# Altium project iMX6 Rex Development Baseboard V1I1.PrjPcb (part 3 of 5)

## Sheet [11] - AUDIO1.SchDoc
size A2; DocumentNumber: 2; SheetNumber: 11; SheetTotal: 20
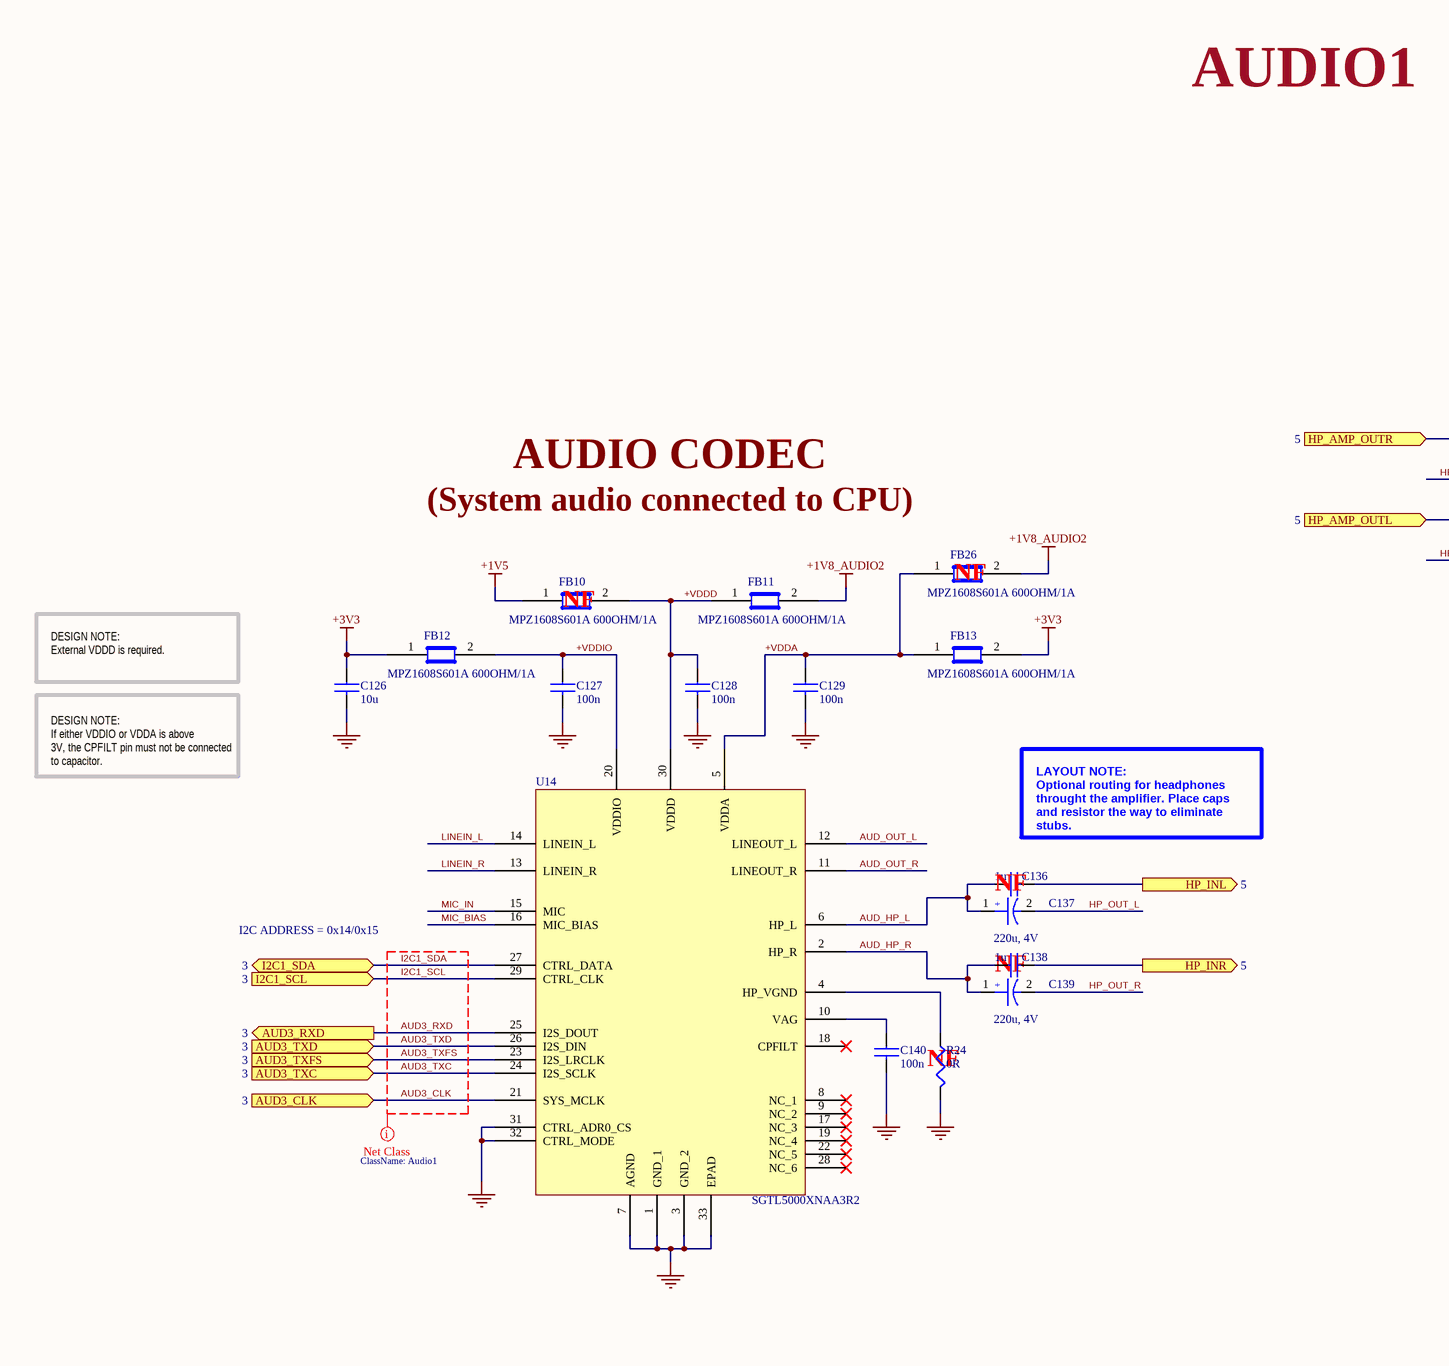
[diagram p7: [11] - AUDIO1.SchDoc, left]
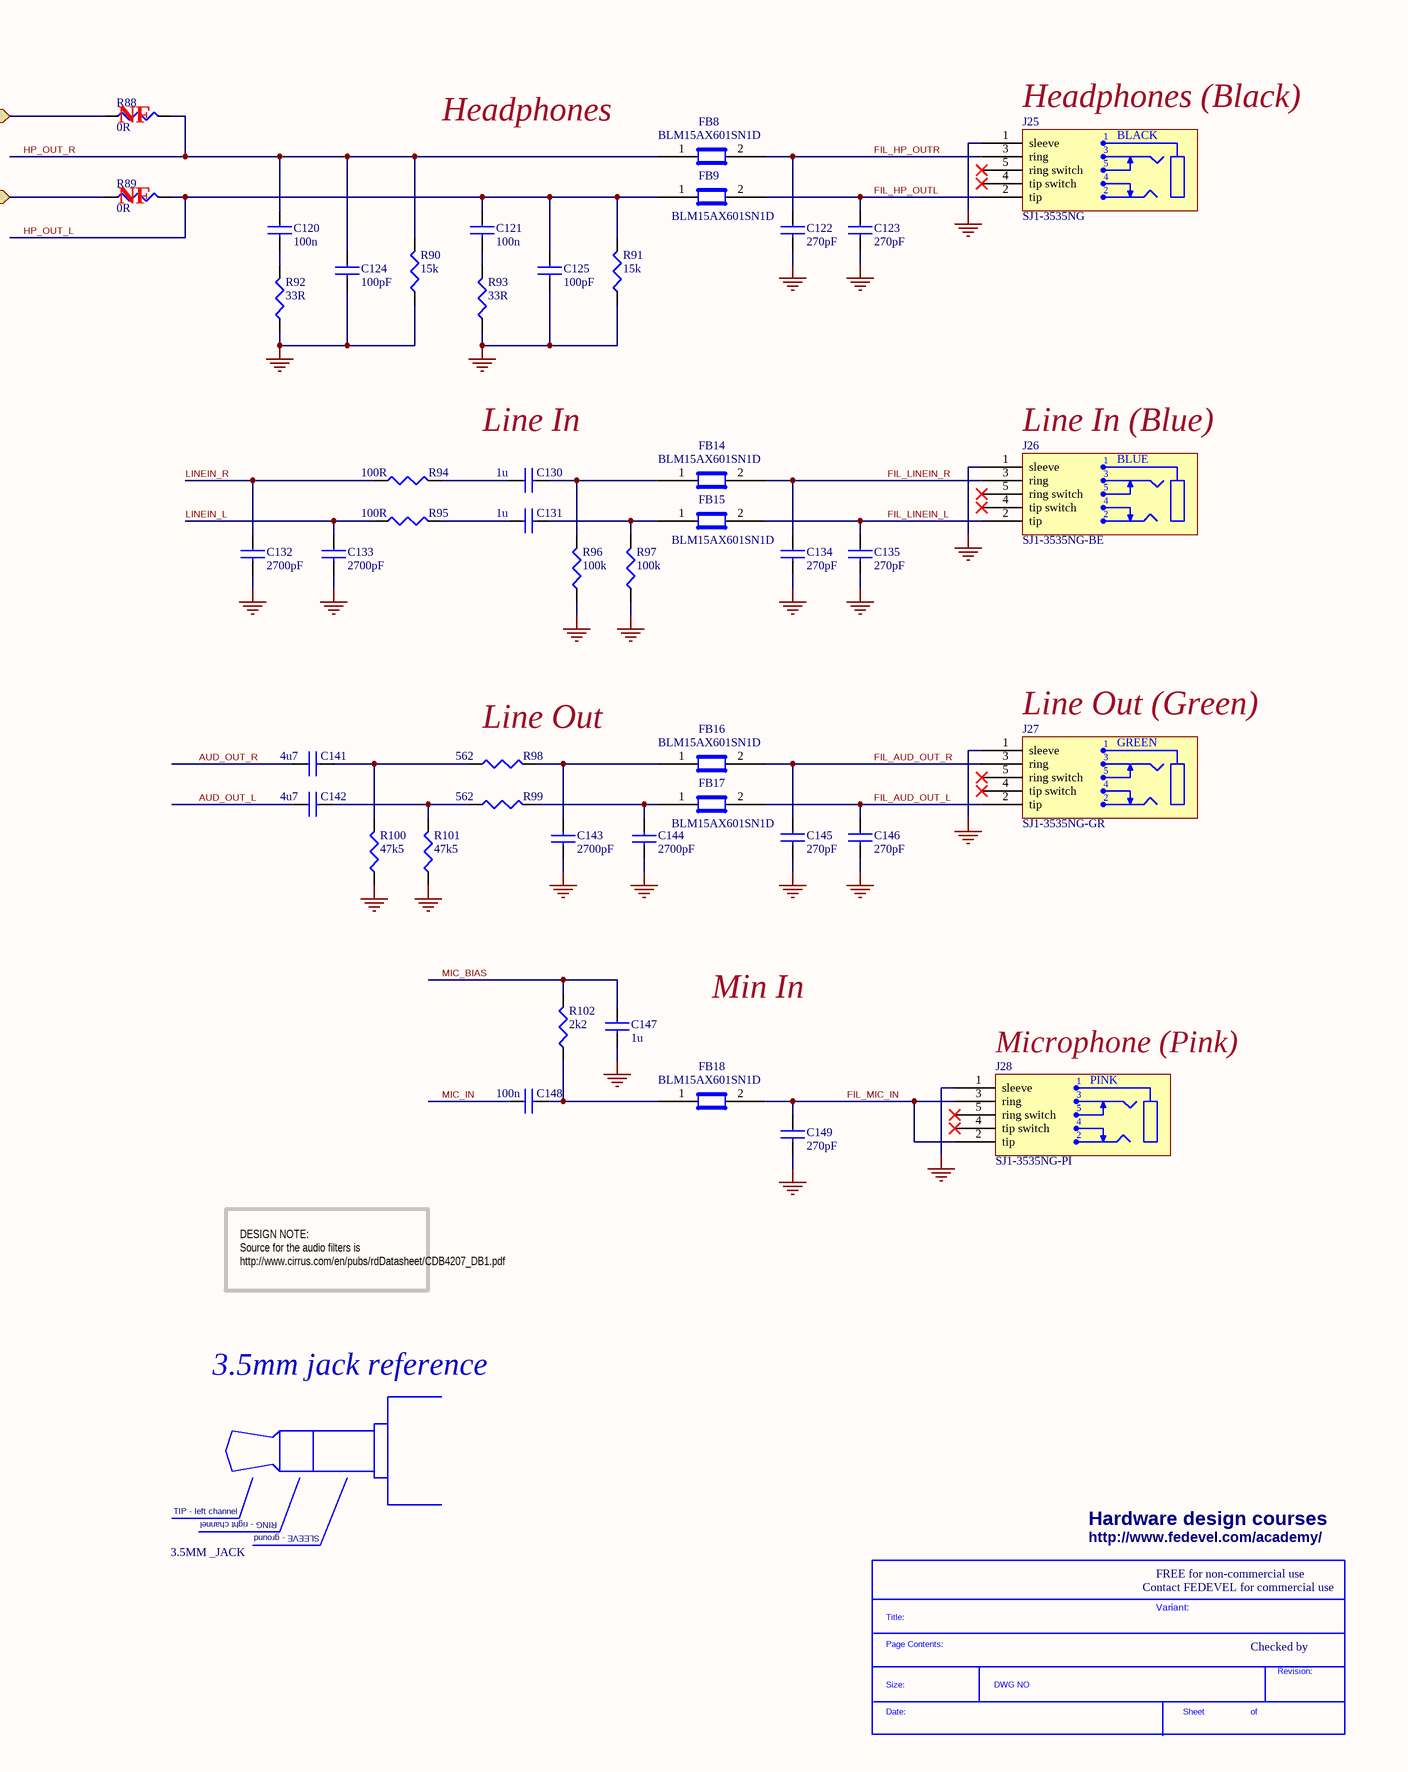
[diagram p8: [11] - AUDIO1.SchDoc, right]

### Parts
(Parts that share a designator on the sheet are numbered #1, #2 ... from top to bottom, then left to right.)
*#6  3.5MM _JACK  (graphical)
*#7  SDTitleBlock  (value not drawn)  (graphical)
C120  100n  [C0402]
C121  100n  [C0402]
C122  270pF  [C0402]
C123  270pF  [C0402]
C124  100pF  [C0402]
C125  100pF  [C0402]
C126  10u  [C0603]
C127  100n  [C0402]
C128  100n  [C0402]
C129  100n  [C0402]
C130  1u  [C0402]
C131  1u  [C0402]
C132  2700pF  [C0402]
C133  2700pF  [C0402]
C134  270pF  [C0402]
C135  270pF  [C0402]
C136  1u  [C0402]
C137  220u, 4V  [C1206 -  TLN S Case Tantal]
C138  1u  [C0402]
C139  220u, 4V  [C1206 -  TLN S Case Tantal]
C140  100n  [C0402]
C141  4u7  [C0402]
C142  4u7  [C0402]
C143  2700pF  [C0402]
C144  2700pF  [C0402]
C145  270pF  [C0402]
C146  270pF  [C0402]
C147  1u  [C0402]
C148  100n  [C0402]
C149  270pF  [C0402]
FB8  BLM15AX601SN1D  [C0402]
FB9  BLM15AX601SN1D  [C0402]
FB10  MPZ1608S601A 600OHM/1A  [C0603]
FB11  MPZ1608S601A 600OHM/1A  [C0603]
FB12  MPZ1608S601A 600OHM/1A  [C0603]
FB13  MPZ1608S601A 600OHM/1A  [C0603]
FB14  BLM15AX601SN1D  [C0402]
FB15  BLM15AX601SN1D  [C0402]
FB16  BLM15AX601SN1D  [C0402]
FB17  BLM15AX601SN1D  [C0402]
FB18  BLM15AX601SN1D  [C0402]
FB26  MPZ1608S601A 600OHM/1A  [C0603]
J25  SJ1-3535NG  [SJ1-3535NG]
J26  SJ1-3535NG-BE  [SJ1-3535NG]
J27  SJ1-3535NG-GR  [SJ1-3535NG]
J28  SJ1-3535NG-PI  [SJ1-3535NG]
R24  0R  [R0402]
R88  0R  [R0402]
R89  0R  [R0402]
R90  15k  [R0402]
R91  15k  [R0402]
R92  33R  [R0402]
R93  33R  [R0402]
R94  100R  [R0402]
R95  100R  [R0402]
R96  100k  [R0402]
R97  100k  [R0402]
R98  562  [R0402]
R99  562  [R0402]
R100  47k5  [R0402]
R101  47k5  [R0402]
R102  2k2  [R0402]
U14  SGTL5000XNAA3R2  [QFN32 5x5x0.85]

### Ports
AUD3_CLK (in, see 3), AUD3_RXD (out, see 3), AUD3_TXC (in, see 3), AUD3_TXD (in, see 3), AUD3_TXFS (in, see 3), HP_AMP_OUTL (in, see 5), HP_AMP_OUTR (in, see 5), HP_INL (out, see 5), HP_INR (out, see 5), I2C1_SCL (in, see 3), I2C1_SDA (bidir, see 3)

### Nets
+1V5: FB10.1
+1V8_AUDIO2: FB11.2 FB26.2
+3V3: C126.1 FB12.1 FB13.2
GND: C122.2 C123.2 C124.2 C125.2 C126.2 C127.2 C128.2 C129.2 C132.2 C133.2 C134.2 C135.2 C140.2 C143.1 C144.1 C145.2 C146.2 C147.2 C149.2 J25.1(sleeve) J26.1(sleeve) J27.1(sleeve) J28.1(sleeve) R24.2 R90.1 R91.1 R92.1 R93.1 R96.1 R97.1 R100.1 R101.1 U14.1(GND_1) U14.3(GND_2) U14.7(AGND) U14.31(CTRL_ADR0_CS) U14.32(CTRL_MODE) U14.33(EPAD)
+VDDA: C129.1 FB13.1 FB26.1 U14.5(VDDA)
+VDDD: C128.1 FB10.2 FB11.1 U14.30(VDDD)
+VDDIO: C127.1 FB12.2 U14.20(VDDIO)
AUD3_CLK: U14.21(SYS_MCLK) ; port AUD3_CLK
AUD3_RXD: U14.25(I2S_DOUT) ; port AUD3_RXD
AUD3_TXC: U14.24(I2S_SCLK) ; port AUD3_TXC
AUD3_TXD: U14.26(I2S_DIN) ; port AUD3_TXD
AUD3_TXFS: U14.23(I2S_LRCLK) ; port AUD3_TXFS
AUD_HP_L: C136.1 C137.1 U14.6(HP_L)
AUD_HP_R: C138.1 C139.1 U14.2(HP_R)
AUD_OUT_L: C142.1 U14.12(LINEOUT_L)
AUD_OUT_R: C141.1 U14.11(LINEOUT_R)
FIL_AUD_OUT_L: C146.1 FB17.2 J27.2(tip)
FIL_AUD_OUT_R: C145.1 FB16.2 J27.3(ring)
FIL_HP_OUTL: C123.1 FB9.2 J25.2(tip)
FIL_HP_OUTR: C122.1 FB8.2 J25.3(ring)
FIL_LINEIN_L: C135.1 FB15.2 J26.2(tip)
FIL_LINEIN_R: C134.1 FB14.2 J26.3(ring)
FIL_MIC_IN: C149.1 FB18.2 J28.2(tip) J28.3(ring)
HP_AMP_OUTL: R89.1 ; port HP_AMP_OUTL
HP_AMP_OUTR: R88.1 ; port HP_AMP_OUTR
HP_INL: C136.2 ; port HP_INL
HP_INR: C138.2 ; port HP_INR
HP_OUT_L: C121.1 C125.1 C137.2 FB9.1 R89.2 R91.2
HP_OUT_R: C120.1 C124.1 C139.2 FB8.1 R88.2 R90.2
I2C1_SCL: U14.29(CTRL_CLK) ; port I2C1_SCL
I2C1_SDA: U14.27(CTRL_DATA) ; port I2C1_SDA
LINEIN_L: C133.1 R95.1 U14.14(LINEIN_L)
LINEIN_R: C132.1 R94.1 U14.13(LINEIN_R)
MIC_BIAS: C147.1 R102.2 U14.16(MIC_BIAS)
MIC_IN: C148.1 U14.15(MIC)
NetC120_2: C120.2 R92.2
NetC121_2: C121.2 R93.2
NetC130_1: C130.1 R94.2
NetC130_2: C130.2 FB14.1 R96.2
NetC131_1: C131.1 R95.2
NetC131_2: C131.2 FB15.1 R97.2
NetC140_1: C140.1 U14.10(VAG)
NetC141_2: C141.2 R98.1 R100.2
NetC142_2: C142.2 R99.1 R101.2
NetC143_2: C143.2 FB16.1 R98.2
NetC144_2: C144.2 FB17.1 R99.2
NetC148_2: C148.2 FB18.1 R102.1
NetR24_1: R24.1 U14.4(HP_VGND)

Not connected (* = marked no-connect by the designer): J25 4(tip_switch)* 5(ring_switch)*; J26 4(tip_switch)* 5(ring_switch)*; J27 4(tip_switch)* 5(ring_switch)*; J28 4(tip_switch)* 5(ring_switch)*; U14 8(NC_1)* 9(NC_2)* 17(NC_3)* 18(CPFILT)* 19(NC_4)* 22(NC_5)* 28(NC_6)*

### Layout directives
net class Audio1: AUD3_CLK, AUD3_RXD, AUD3_TXC, AUD3_TXD, AUD3_TXFS, I2C1_SCL, I2C1_SDA

### Notes on the sheet
- AUDIO1
- (near J25) Headphones (Black)
- AUDIO CODEC
- (near R88) NF
- Headphones
- (System audio connected to CPU)
- (near R89) NF
- (near FB10) NF
- (near FB26) NF
- DESIGN NOTE:
  External VDDD is required.
- DESIGN NOTE:
  If either VDDIO or VDDA is above
  3V, the CPFILT pin must not be connected to capacitor.
- (near C130) Line In
- (near J26) Line In (Blue)
- (near C136) LAYOUT NOTE:
  Optional routing for headphones throught the amplifier. Place caps and resistor the way to eliminate stubs.
- (near C136) NF
- I2C ADDRESS = 0x14/0x15
- (near C138) NF
- (near J27) Line Out (Green)
- (near R24) NF
- (near R98) Line Out
- Min In
- (near J28) Microphone (Pink)
- DESIGN NOTE:
  Source for the audio filters is http://www.cirrus.com/en/pubs/rdDatasheet/CDB4207_DB1.pdf
- 3.5mm jack reference
- Hardware design courses
- http://www.fedevel.com/academy/
- Contact FEDEVEL for commercial use
- FREE for non-commercial use
- Variant:
- Checked by
- (in symbol 3.5MM _JACK) TIP - left channel; RING - right channel; SLEEVE - ground
- (in symbol SDTitleBlock) Title:; Page Contents:; Revision:; Size:; DWG NO; Date:; Sheet; of
- (in symbol SJ1-3535NG) BLACK
- (in symbol SJ1-3535NG-BE) BLUE
- (in symbol SJ1-3535NG-GR) GREEN
- (in symbol SJ1-3535NG-PI) PINK
- (in symbol TLNS227M004R3000) +

### Library data of the parts
C120 C121 C127-C129 C140 C148 = C1005X5R1H104K: CAP CER .10UF 50V X5R 10% 0402; Manufacturer: TDK Corporation; Capacitance: 0.1µF; Value: 100nF; .Checked PCB: used; Description: CAP CER 0.1UF 50V 10% X5R 0402; Category: Capacitors; Supplier Part Number: 445-5942-1-ND; Manufacturer Part Number: C1005X5R1H104K; Operating Temperature: -55°C ~ 85°C; Package / Case: 0402 (1005 Metric); Price 1k [$]: 0.02340; .Checked SCH: used; Voltage - Rated: 50V; Supplier: Digikey; Supplier 1: Digi-Key; Supplier Part Number 1: 445-5942-1-ND; RoHS: RoHS Compliant; Stock 1: 106926; Pricing 1: 1=0.27, 10=0.18, 100=0.072, 250=0.05176, 500=0.0369, 1000=0.027 (USD); Tolerance: ±10%; Temperature Coefficient: X5R; Mounting Type: Surface Mount, MLCC; Applications: General Purpose; Ratings: -; Size / Dimension: 0.039" L x 0.020" W (1.00mm x 0.50mm); Height - Seated (Max): -; Thickness (Max): 0.022" (0.55mm); Lead Spacing: -; Features: -; Packaging: Cut Tape (CT); Lead Style: -; ComponentLink1URL: http://www.tdk.co.jp/tefe02/e412_c.pdf; ComponentLink1Description: http://www.tdk.co.jp/tefe02/e412_c.pdf
C122 C123 C134 C135 C145 C146 C149 = GRM155R71H271KA01D: CAP CER 270PF 50V 10% X7R 0402; Manufacturer: Murata Electronics North America; .Checked PCB: RF; Supplier 1: Digi-Key; Supplier Part Number 1: 490-1299-1-ND; Manufacturer Part Number: GRM155R71H271KA01D; RoHS: RoHS Compliant; Category: Capacitors; Stock 1: 83894; Pricing 1: 10=0.032, 50=0.0252, 100=0.0189, 250=0.01364, 500=0.01008, 1000=0.00683, 5000=0.00525 (USD); Capacitance: 270pF; Voltage - Rated: 50V; Tolerance: ±10%; Temperature Coefficient: X7R; Mounting Type: Surface Mount, MLCC; Operating Temperature: -55°C ~ 125°C; Applications: General Purpose; Ratings: -; Package / Case: 0402 (1005 Metric); Size / Dimension: 0.039" L x 0.020" W (1.00mm x 0.50mm); Height - Seated (Max): -; Thickness (Max): 0.022" (0.55mm); Lead Spacing: -; Features: -; Packaging: Cut Tape (CT); Lead Style: -; ComponentLink1URL: http://search.murata.co.jp/Ceramy/image/img/PDF/ENG/GRM155R71H271KA01.pdf; ComponentLink1Description: http://search.murata.co.jp/Ceramy/image/img/PDF/ENG/GRM155R71H271KA01.pdf; .Checked SCH: RF
C124 C125 = C1005C0G1H101J: CAP CER 100PF 50V 5% NP0 0402; Manufacturer: TDK Corporation; Temperature Coefficient: C0G, NP0; .Checked PCB: RF; Supplier 1: Digi-Key; Supplier Part Number 1: 445-1247-1-ND; Manufacturer Part Number: C1005C0G1H101J; RoHS: RoHS Compliant; Category: Capacitors; Stock 1: 298233; Pricing 1: 1=0.08, 10=0.05, 100=0.018, 250=0.013, 500=0.0096, 1000=0.0065 (USD); Capacitance: 100pF; Voltage - Rated: 50V; Tolerance: ±5%; Mounting Type: Surface Mount, MLCC; Operating Temperature: -55°C ~ 125°C; Applications: General Purpose; Ratings: -; Package / Case: 0402 (1005 Metric); Size / Dimension: 0.039" L x 0.020" W (1.00mm x 0.50mm); Height - Seated (Max): -; Thickness (Max): 0.022" (0.55mm); Lead Spacing: -; Features: -; Packaging: Cut Tape (CT); Lead Style: -; ComponentLink1URL: http://www.tdk.com/pdf/general_B11.pdf; ComponentLink1Description: http://www.tdk.com/pdf/general_B11.pdf; .Checked SCH: RF
C126 = C1608X5R0J106M: CAP CER 10UF 6.3V X5R 20% 0603; Manufacturer: TDK Corporation; Capacitance: 10µF; Value: 10µF; .Checked PCB: used; Description: CAP CER 10UF 6.3V 20% X5R 0603; Category: Capacitors; Supplier Part Number: 445-4112-1-ND; Manufacturer Part Number: C1608X5R0J106M; Operating Temperature: -55°C ~ 85°C; Package / Case: 0603 (1608 Metric); Price 1k [$]: 0.08580; .Checked SCH: used; Voltage - Rated: 6.3V; Features: Low ESR; Supplier: Digikey; Supplier 1: Digi-Key; Supplier Part Number 1: 445-4112-1-ND; RoHS: RoHS Compliant; Stock 1: 48157; Pricing 1: 1=0.46, 10=0.363, 100=0.1898, 250=0.14024, 500=0.1089, 1000=0.0858 (USD); Tolerance: ±20%; Temperature Coefficient: X5R; Mounting Type: Surface Mount, MLCC; Applications: General Purpose; Ratings: -; Size / Dimension: 0.063" L x 0.031" W (1.60mm x 0.80mm); Height - Seated (Max): -; Thickness (Max): 0.037" (0.95mm); Lead Spacing: -; Packaging: Cut Tape (CT); Lead Style: -; ComponentLink1URL: http://www.tdk.com/pdf/general_B11.pdf; ComponentLink1Description: http://www.tdk.com/pdf/general_B11.pdf
C130 C131 C136 C138 C147 = C1005X5R1C105K: CAP CER 1.0UF 16V X5R 0402; Manufacturer: TDK Corporation; Capacitance: 1.0µF; Value: 1uF; .Checked PCB: used; Description: CAP CER 1UF 16V 10% X5R 0402; Tolerance: ±10%; Category: Capacitors; Supplier Part Number: 445-4978-1-ND; Manufacturer Part Number: C1005X5R1C105K; Operating Temperature: -55°C ~ 85°C; Package / Case: 0402 (1005 Metric); Price 1k [$]: 0.02080; .Checked SCH: used; Voltage - Rated: 16V; Supplier: Digikey; Supplier 1: Digi-Key; Supplier Part Number 1: 445-4978-1-ND; RoHS: RoHS Compliant; Stock 1: 341010; Pricing 1: 1=0.24, 10=0.16, 100=0.064, 250=0.046, 500=0.0328, 1000=0.024 (USD); Temperature Coefficient: X5R; Mounting Type: Surface Mount, MLCC; Applications: General Purpose; Ratings: -; Size / Dimension: 0.039" L x 0.020" W (1.00mm x 0.50mm); Height - Seated (Max): -; Thickness (Max): 0.022" (0.55mm); Lead Spacing: -; Features: -; Packaging: Cut Tape (CT); Lead Style: -; ComponentLink1URL: http://www.tdk.co.jp/tefe02/e412_c.pdf; ComponentLink1Description: http://www.tdk.co.jp/tefe02/e412_c.pdf
C132 C133 C143 C144 = GRM155R71H272KA01D: CAP CER 2700PF 50V 10% X7R 0402; Manufacturer: Murata Electronics North America; .Checked PCB: RF; Supplier 1: Digi-Key; Supplier Part Number 1: 490-1306-1-ND; Manufacturer Part Number: GRM155R71H272KA01D; RoHS: RoHS Compliant; Category: Capacitors; Stock 1: 38160; Pricing 1: 10=0.01, 50=0.0086, 100=0.0074, 250=0.00664, 500=0.00618, 750=0.00571, 1000=0.00542 (USD); Capacitance: 2700pF; Voltage - Rated: 50V; Tolerance: ±10%; Temperature Coefficient: X7R; Mounting Type: Surface Mount, MLCC; Operating Temperature: -55°C ~ 125°C; Applications: General Purpose; Ratings: -; Package / Case: 0402 (1005 Metric); Size / Dimension: 0.039" L x 0.020" W (1.00mm x 0.50mm); Height - Seated (Max): -; Thickness (Max): 0.022" (0.55mm); Lead Spacing: -; Features: -; Packaging: Cut Tape (CT); Lead Style: -; ComponentLink1URL: http://search.murata.co.jp/Ceramy/image/img/PDF/ENG/GRM155R71H272KA01.pdf; ComponentLink1Description: http://search.murata.co.jp/Ceramy/image/img/PDF/ENG/GRM155R71H272KA01.pdf; .Checked SCH: RF
C137 C139 = TLNS227M004R3000: CAP TANT 220UF 4V 20% 1206; Manufacturer: AVX Corporation; Manufacturer Size Code: S; Capacitance: 220µF; ESR (Equivalent Series Resistance): 3.000 Ohm; Type: Molded; .Checked PCB: MM; Supplier 1: Digi-Key; Supplier Part Number 1: 478-5526-1-ND; Manufacturer Part Number: TLNS227M004R3000; RoHS: RoHS Compliant; Category: Capacitors; Stock 1: 21393; Pricing 1: 1=1.35, 10=1.128, 100=0.72, 250=0.6, 500=0.54, 1000=0.492 (USD); Voltage - Rated: 4V; Tolerance: ±20%; Operating Temperature: -55°C ~ 125°C; Mounting Type: Surface Mount; Package / Case: 1206 (3216 Metric); Size / Dimension: 0.126" L x 0.063" W (3.20mm x 1.60mm); Height - Seated (Max): 0.047" (1.20mm); Lead Spacing: -; Features: General Purpose; Packaging: Cut Tape (CT); Lifetime @ Temp.: -; ComponentLink1URL: http://www.avx.com/docs/Catalogs/tlnunder.pdf; ComponentLink1Description: http://www.avx.com/docs/Catalogs/tlnunder.pdf; .Checked SCH: MM
C141 C142 = C1005X5R1A475M: CAP CER 4.7UF 10V 20% X5R 0402; Manufacturer: TDK Corporation; Capacitance: 4.7µF; .Checked PCB: RF; Supplier 1: Digi-Key; Supplier Part Number 1: 445-8023-1-ND; Manufacturer Part Number: C1005X5R1A475M; RoHS: RoHS Compliant; Category: Capacitors; Stock 1: 10140; Pricing 1: 1=0.53, 10=0.415, 100=0.25, 250=0.18752, 500=0.16, 1000=0.125, 5000=0.095 (USD); Voltage - Rated: 10V; Tolerance: ±20%; Temperature Coefficient: X5R; Mounting Type: Surface Mount, MLCC; Operating Temperature: -55°C ~ 85°C; Applications: General Purpose; Ratings: -; Package / Case: 0402 (1005 Metric); Size / Dimension: 0.039" L x 0.020" W (1.00mm x 0.50mm); Height - Seated (Max): -; Thickness (Max): -; Lead Spacing: -; Features: -; Packaging: Cut Tape (CT); Lead Style: -; ComponentLink1URL: http://www.tdk.com/pdf/general_B11.pdf; ComponentLink1Description: http://www.tdk.com/pdf/general_B11.pdf; .Checked SCH: RF
FB8 FB9 FB14-FB18 = BLM15AX601SN1D: FERRITE CHIP 600 OHM 0402 420mA; Manufacturer: Murata Electronics North America; .Checked PCB: used; Impedance @ Frequency: 600 Ohm @ 100MHz; DC Resistance (DCR): 340 mOhm Max; Filter Type: Differential Mode - Single; Number of Lines: 1; .Checked SCH: used; Category: Filters; Supplier Part Number: 490-5441-1-ND; Manufacturer Part Number: BLM15AX601SN1D; Package / Case: 0402 (1005 Metric); Price 1k [$]: 0.03280; Value: BLM15AX601SN1D; Current Rating: 420mA; Supplier: Digikey; Supplier 1: Digi-Key; Supplier Part Number 1: 490-5441-1-ND; RoHS: RoHS Compliant; Description: FERRITE CHIP 600 OHM 0402; Stock 1: 34008; Pricing 1: 1=0.26, 10=0.197, 50=0.1148, 100=0.0918, 250=0.0656, 500=0.0446, 1000=0.03608, 5000=0.02821 (USD); Mounting Type: Surface Mount; Packaging: Cut Tape (CT); Height (Max): 0.022" (0.55mm); Size / Dimension: 0.039" L x 0.020" W (1.00mm x 0.50mm); ComponentLink1URL: http://search.murata.co.jp/Ceramy/image/img/PDF/ENG/L0110S0100BLM15AX_SN.pdf; ComponentLink1Description: http://search.murata.co.jp/Ceramy/image/img/PDF/ENG/L0110S0100BLM15AX_SN.pdf
FB10-FB13 FB26 = MPZ1608S601A: FERRITE CHIP BEAD 600 OHM SMD 1A; Manufacturer: TDK Corporation; Impedance @ Frequency: 600 Ohm @ 100MHz; DC Resistance (DCR): 150 mOhm Max; Filter Type: Differential Mode - Single; Number of Lines: 1; .Checked PCB: RF; Supplier 1: Digi-Key; Supplier Part Number 1: 445-2205-1-ND; Manufacturer Part Number: MPZ1608S601A; RoHS: RoHS Compliant; Description: FERRITE CHIP BEAD 600 OHM SMD; Category: Filters; Stock 1: 328345; Pricing 1: 1=0.36, 10=0.24, 100=0.096, 250=0.069, 500=0.0492, 1000=0.036 (USD); Current Rating: 1A; Package / Case: 0603 (1608 Metric); Mounting Type: Surface Mount; Packaging: Cut Tape (CT); Height (Max): 0.037" (0.95mm); Size / Dimension: 0.063" L x 0.031" W (1.60mm x 0.80mm); ComponentLink1URL: http://www.tdk.co.jp/tefe02/e9413_mpz.pdf; ComponentLink1Description: http://www.tdk.co.jp/tefe02/e9413_mpz.pdf; .Checked SCH: RF
J25 = SJ1-3535NG: CONN JACK STEREO R/A 5PIN 3.5MM; Manufacturer: CUI Inc; Connector Type: Phone Jack; Gender: Female; Plug/Mating Plug Diameter: 3.50mm (0.141", 1/8", Mini Plug) - Headphone; Number of Positions/Contacts: 3 Conductors, 5 Contacts; Internal Switch(s): Two Switches; Shielding: Unshielded; Color - Contact: Black; Voltage - Rated: 16VDC; Current Rating: 300mA; .Checked PCB: RF; Supplier 1: Digi-Key; Manufacturer Part Number: SJ1-3535NG; RoHS: RoHS Compliant; Category: Connectors, Interconnects; Stock 1: 16873; Pricing 1: 1=0.89, 10=0.686, 100=0.5235, 500=0.41878, 1000=0.37226, 2500=0.30944 (GBP); Signal Lines: Stereo; Mounting Type: Through Hole, Right Angle; Termination: Solder; Features: -; Contact Material: Brass; Contact Material - Plating: Tin; Housing Material: Steel; Housing Color: Silver; Operating Temperature: -25°C ~ 85°C; Packaging: Bulk; ComponentLink1URL: http://www.cui.com/Product/Resource/DigiKeyPDF/SJ1-353XNG_Series.pdf; ComponentLink1Description: http://www.cui.com/Product/Resource/DigiKeyPDF/SJ1-353XNG_Series.pdf; Supplier Part Number 1: CP1-3535NG-ND; .Checked SCH: RF
J26 = SJ1-3535NG-BE: CONN JACK STEREO 5POS 3.5MM PCB; Manufacturer: CUI Inc; Connector Type: Phone Jack; Gender: Female; Plug/Mating Plug Diameter: 3.50mm (0.141", 1/8", Mini Plug) - Headphone; Number of Positions/Contacts: 3 Conductors, 5 Contacts; Internal Switch(s): Two Switches; Shielding: Unshielded; Color - Contact: Blue; Voltage - Rated: 16VDC; Current Rating: 300mA; .Checked PCB: RF; Supplier 1: Digi-Key; Manufacturer Part Number: SJ1-3535NG-BE; RoHS: RoHS Compliant; Category: Connectors, Interconnects; Stock 1: 2486; Pricing 1: 1=0.97, 10=0.755, 100=0.5757, 500=0.46054, 1000=0.40937, 2500=0.34029 (GBP); Signal Lines: Stereo; Mounting Type: Through Hole, Right Angle; Termination: Solder; Features: -; Contact Material: Brass; Contact Material - Plating: Tin; Housing Material: Steel; Housing Color: Silver; Operating Temperature: -25°C ~ 85°C; Packaging: Bulk; ComponentLink1URL: http://www.cui.com/Product/Resource/DigiKeyPDF/SJ1-353XNG_Series.pdf; ComponentLink1Description: http://www.cui.com/Product/Resource/DigiKeyPDF/SJ1-353XNG_Series.pdf; Supplier Part Number 1: CP1-3535NG-BE-ND; .Checked SCH: RF
J27 = SJ1-3535NG-GR: CONN JACK STEREO 5POS 3.5MM PCB; Manufacturer: CUI Inc; Connector Type: Phone Jack; Gender: Female; Plug/Mating Plug Diameter: 3.50mm (0.141", 1/8", Mini Plug) - Headphone; Number of Positions/Contacts: 3 Conductors, 5 Contacts; Internal Switch(s): Two Switches; Shielding: Unshielded; Color - Contact: Green; Voltage - Rated: 16VDC; Current Rating: 300mA; .Checked PCB: RF; Supplier 1: Digi-Key; Manufacturer Part Number: SJ1-3535NG-GR; RoHS: RoHS Compliant; Category: Connectors, Interconnects; Stock 1: 5298; Pricing 1: 1=0.97, 10=0.755, 100=0.5757, 500=0.46054, 1000=0.40937, 2500=0.34029 (GBP); Signal Lines: Stereo; Mounting Type: Through Hole, Right Angle; Termination: Solder; Features: -; Contact Material: Brass; Contact Material - Plating: Tin; Housing Material: Steel; Housing Color: Silver; Operating Temperature: -25°C ~ 85°C; Packaging: Bulk; ComponentLink1URL: http://www.cui.com/Product/Resource/DigiKeyPDF/SJ1-353XNG_Series.pdf; ComponentLink1Description: http://www.cui.com/Product/Resource/DigiKeyPDF/SJ1-353XNG_Series.pdf; Supplier Part Number 1: CP1-3535NG-GR-ND; .Checked SCH: RF
J28 = SJ1-3535NG-PI: CONN JACK STEREO 5POS 3.5MM PCB; Manufacturer: CUI Inc; Connector Type: Phone Jack; Gender: Female; Plug/Mating Plug Diameter: 3.50mm (0.141", 1/8", Mini Plug) - Headphone; Number of Positions/Contacts: 3 Conductors, 5 Contacts; Internal Switch(s): Two Switches; Shielding: Unshielded; Color - Contact: Pink; Voltage - Rated: 16VDC; Current Rating: 300mA; .Checked PCB: RF; Supplier 1: Digi-Key; Manufacturer Part Number: SJ1-3535NG-PI; RoHS: RoHS Compliant; Category: Connectors, Interconnects; Stock 1: 2666; Pricing 1: 1=1.38, 10=1.074, 100=0.819, 500=0.6552, 1000=0.5824, 2500=0.48412 (USD); Signal Lines: Stereo; Mounting Type: Through Hole, Right Angle; Termination: Solder; Features: -; Contact Material: Brass; Contact Material - Plating: Tin; Housing Material: Steel; Housing Color: Silver; Operating Temperature: -25°C ~ 85°C; Packaging: Bulk; ComponentLink1URL: http://www.cui.com/Product/Resource/DigiKeyPDF/SJ1-353XNG_Series.pdf; ComponentLink1Description: http://www.cui.com/Product/Resource/DigiKeyPDF/SJ1-353XNG_Series.pdf; Supplier Part Number 1: CP1-3535NG-PI-ND; .Checked SCH: RF
R24 R88 R89 = RC0402JR-070RL: RES 0.0 OHM 1/16W 0402 SMD; Manufacturer: Yageo; Resistance (Ohms): 0.0; Power (Watts): 0.063W, 1/16W; Tolerance: Jumper; .Checked PCB: used; Category: Resistors; Supplier Part Number: 311-0.0JRCT-ND; Manufacturer Part Number: RC0402JR-070RL; Package / Case: 0402 (1005 Metric); Price 1k [$]: 0.01389; Value: 0R; .Checked SCH: used; Supplier: Digikey; Supplier 1: Digi-Key; Supplier Part Number 1: 311-0.0JRCT-ND; RoHS: RoHS Compliant; Stock 1: 1106330; Pricing 1: 10=0.012, 50=0.009, 100=0.0069, 250=0.00512, 500=0.0038, 1000=0.00253 (USD); Composition: Thick Film; Features: -; Temperature Coefficient: -; Size / Dimension: 0.039" L x 0.020" W (1.00mm x 0.50mm); Height: 0.016" (0.40mm); Number of Terminations: 2; Packaging: Cut Tape (CT); ComponentLink1URL: http://www.yageo.com/documents/recent/PYu-RC0402_51_RoHS_L_6.pdf; ComponentLink1Description: http://www.yageo.com/documents/recent/PYu-RC0402_51_RoHS_L_6.pdf
R90 R91 = RC0402FR-0715KL: RES 15.0K OHM 1/16W 1% 0402 SMD; Manufacturer: Yageo; Power (Watts): 0.063W, 1/16W; .Checked PCB: used; Temperature Coefficient: ±100ppm/°C; Category: Resistors; Supplier Part Number: 311-15.0KLRCT-ND; Manufacturer Part Number: RC0402FR-0715KL; Package / Case: 0402 (1005 Metric); Price 1k [$]: 0.01421; Resistance (Ohms): 15K; Tolerance: ±1%; Value: 15k; .Checked SCH: used; Supplier: Digikey; Supplier 1: Digi-Key; Supplier Part Number 1: 311-15.0KLRCT-ND; RoHS: RoHS Compliant; Stock 1: 31992; Pricing 1: 10=0.014, 50=0.0104, 100=0.0079, 250=0.00584, 500=0.00432, 1000=0.00288 (USD); Composition: Thick Film; Features: -; Size / Dimension: 0.039" L x 0.020" W (1.00mm x 0.50mm); Height: 0.016" (0.40mm); Number of Terminations: 2; Packaging: Cut Tape (CT); ComponentLink1URL: http://www.yageo.com/documents/recent/PYu-RC0402_51_RoHS_L_6.pdf; ComponentLink1Description: http://www.yageo.com/documents/recent/PYu-RC0402_51_RoHS_L_6.pdf
R92 R93 = RMCF0402FT33R0: RES TF 33 OHM 1% 1/16W 0402; Manufacturer: Stackpole Electronics Inc; Resistance (Ohms): 33; Power (Watts): 0.063W, 1/16W; .Checked PCB: RF; Temperature Coefficient: ±100ppm/°C; Category: Resistors; Supplier Part Number: RMCF0402FT33R0CT-ND; Manufacturer Part Number: RMCF0402FT33R0; Package / Case: 0402 (1005 Metric); Price 1k [$]: 0.00384; Tolerance: ±1%; Value: 33R; .Checked SCH: RF; Supplier: Digikey; Supplier 1: Digi-Key; Supplier Part Number 1: RMCF0402FT33R0CT-ND; RoHS: RoHS Compliant; Stock 1: 26866; Pricing 1: 1=0.04, 10=0.025, 50=0.0138, 100=0.0105, 250=0.0078, 500=0.00576, 1000=0.00384 (USD); Composition: Thick Film; Features: -; Size / Dimension: 0.039" L x 0.020" W (1.00mm x 0.50mm); Height: 0.016" (0.40mm); Number of Terminations: 2; Packaging: Cut Tape (CT); ComponentLink1URL: http://www.seielect.com/Catalog/SEI-RMCF.pdf; ComponentLink1Description: http://www.seielect.com/Catalog/SEI-RMCF.pdf
R94 R95 = RC0402FR-07100RL: RES 100 OHM 1/16W 1% 0402 SMD; Manufacturer: Yageo; Resistance (Ohms): 100; Power (Watts): 0.063W, 1/16W; .Checked PCB: RF; Temperature Coefficient: ±100ppm/°C; Category: Resistors; Supplier Part Number: 311-100LRCT-ND; Manufacturer Part Number: RC0402FR-07100RL; Package / Case: 0402 (1005 Metric); Price 1k [$]: 0.01421; Tolerance: ±1%; Value: 100R; .Checked SCH: RF; Supplier: Digikey; Supplier 1: Digi-Key; Supplier Part Number 1: 311-100LRCT-ND; RoHS: RoHS Compliant; Stock 1: 1682040; Pricing 1: 10=0.014, 50=0.0104, 100=0.0079, 250=0.00584, 500=0.00432, 1000=0.00288 (USD); Composition: Thick Film; Features: -; Size / Dimension: 0.039" L x 0.020" W (1.00mm x 0.50mm); Height: 0.016" (0.40mm); Number of Terminations: 2; Packaging: Cut Tape (CT); ComponentLink1URL: http://www.yageo.com/documents/recent/PYu-RC0402_51_RoHS_L_6.pdf; ComponentLink1Description: http://www.yageo.com/documents/recent/PYu-RC0402_51_RoHS_L_6.pdf
R96 R97 = RMCF0402FT100K: RES 100K OHM 1/16W 1% 0402 SMD; Manufacturer: Stackpole Electronics Inc; Power (Watts): 0.063W, 1/16W; .Checked PCB: used; Temperature Coefficient: ±100ppm/°C; Category: Resistors; Supplier Part Number: RMCF0402FT100KCT-ND; Manufacturer Part Number: RMCF0402FT100K; Package / Case: 0402 (1005 Metric); Price 1k [$]: 0.00384; Resistance (Ohms): 100K; Tolerance: ±1%; Value: 100k; .Checked SCH: used; Supplier: Digikey; Supplier 1: Digi-Key; Supplier Part Number 1: RMCF0402FT100KCT-ND; RoHS: RoHS Compliant; Stock 1: 95; Pricing 1: 1=0.04, 10=0.025, 50=0.0138, 100=0.0105, 250=0.0078, 500=0.00576, 1000=0.00384 (USD); Composition: Thick Film; Features: -; Size / Dimension: 0.039" L x 0.020" W (1.00mm x 0.50mm); Height: 0.016" (0.40mm); Number of Terminations: 2; Packaging: Cut Tape (CT); ComponentLink1URL: http://www.seielect.com/Catalog/SEI-RMCF.pdf; ComponentLink1Description: http://www.seielect.com/Catalog/SEI-RMCF.pdf
R98 R99 = CRCW0402562RFKED: RES 562 OHM 1/16W 1% 0402 SMD; Manufacturer: Vishay Dale; Power (Watts): 0.063W, 1/16W; Temperature Coefficient: ±100ppm/°C; .Checked PCB: RF; Supplier 1: Digi-Key; Supplier Part Number 1: 541-562LCT-ND; Manufacturer Part Number: CRCW0402562RFKED; RoHS: RoHS Compliant; Category: Resistors; Stock 1: 34891; Pricing 1: 10=0.083, 50=0.0444, 200=0.0255, 1000=0.0174 (USD); Resistance (Ohms): 562; Composition: Thick Film; Features: -; Tolerance: ±1%; Package / Case: 0402 (1005 Metric); Size / Dimension: 0.039" L x 0.020" W (1.00mm x 0.50mm); Height: 0.016" (0.40mm); Number of Terminations: 2; Packaging: Cut Tape (CT); ComponentLink1URL: http://www.vishay.com/doc?20035; ComponentLink1Description: http://www.vishay.com/doc?20035; .Checked SCH: RF
R100 R101 = RC0402FR-0747K5L: RES 47.5K OHM 1/16W 1% 0402 SMD; Manufacturer: Yageo; Power (Watts): 0.063W, 1/16W; Temperature Coefficient: ±100ppm/°C; .Checked PCB: RF; Supplier 1: Digi-Key; Supplier Part Number 1: 311-47.5KLRCT-ND; Manufacturer Part Number: RC0402FR-0747K5L; RoHS: RoHS Compliant; Category: Resistors; Stock 1: 59607; Pricing 1: 10=0.014, 100=0.0063, 500=0.00382, 1000=0.0027, 5000=0.00203 (USD); Resistance (Ohms): 47.5K; Composition: Thick Film; Features: -; Tolerance: ±1%; Package / Case: 0402 (1005 Metric); Size / Dimension: 0.039" L x 0.020" W (1.00mm x 0.50mm); Height: 0.016" (0.40mm); Number of Terminations: 2; Packaging: Cut Tape (CT); ComponentLink1URL: http://www.yageo.com/documents/recent/PYu-RC0402_51_RoHS_L_6.pdf; ComponentLink1Description: http://www.yageo.com/documents/recent/PYu-RC0402_51_RoHS_L_6.pdf; .Checked SCH: RF
R102 = RC0402FR-072K2L: RES 2.20K OHM 1/16W 1% 0402 SMD; Manufacturer: Yageo; Resistance (Ohms): 2.2K; Power (Watts): 0.063W, 1/16W; .Checked PCB: used; Temperature Coefficient: ±100ppm/°C; Category: Resistors; Supplier Part Number: 311-2.20KLRCT-ND; Manufacturer Part Number: RC0402FR-072K2L; Package / Case: 0402 (1005 Metric); Price 1k [$]: 0.01421; Tolerance: ±1%; Value: 2k2; .Checked SCH: used; Supplier: Digikey; Supplier 1: Digi-Key; Supplier Part Number 1: 311-2.20KLRCT-ND; RoHS: RoHS Compliant; Stock 1: 195154; Pricing 1: 10=0.014, 50=0.0104, 100=0.0079, 250=0.00584, 500=0.00432, 1000=0.00288 (USD); Composition: Thick Film; Features: -; Size / Dimension: 0.039" L x 0.020" W (1.00mm x 0.50mm); Height: 0.016" (0.40mm); Number of Terminations: 2; Packaging: Cut Tape (CT); ComponentLink1URL: http://www.yageo.com/documents/recent/PYu-RC0402_51_RoHS_L_6.pdf; ComponentLink1Description: http://www.yageo.com/documents/recent/PYu-RC0402_51_RoHS_L_6.pdf
U14 = SGTL5000XNAA3R2: IC AUDIO CODEC STEREO 32-QFN; Manufacturer: Freescale Semiconductor; Data Interface: I²C, Serial, SPI™; Number of ADCs / DACs: 1 / 1; Sigma Delta: No; S/N Ratio, ADCs / DACs (db) Typ: 90 / 100; Voltage - Supply, Analog: 1.62 V ~ 3.6 V; Voltage - Supply, Digital: 1.1 V ~ 2 V, 1.62 V ~ 3.6 V; .Creator: MM; .Checked PCB: RF, used by MM; Supplier 1: Digi-Key; Manufacturer Part Number: SGTL5000XNAA3R2; RoHS: RoHS Compliant; Category: Integrated Circuits (ICs); Stock 1: 0; Pricing 1: 1=2.66, 10=2.375, 25=2.2324, 100=2.1375, 250=2.04252, 500=1.9, 1000=1.8525 (USD); Packaging: Cut Tape (CT); Type: Stereo Audio; Resolution (Bits): -; Dynamic Range, ADCs / DACs (db) Typ: -; Operating Temperature: -40°C ~ 85°C; Mounting Type: Surface Mount; Package / Case: 32-VFQFN Exposed Pad; Supplier Device Package: 32-QFN Exposed Pad (5x5); ComponentLink1URL: http://cache.freescale.com/files/analog/doc/data_sheet/SGTL5000.pdf; ComponentLink1Description: http://cache.freescale.com/files/analog/doc/data_sheet/SGTL5000.pdf; Supplier Part Number 1: SGTL5000XNAA3R2CT-ND; .Checked SCH: MM

## Sheet [12] - SD.SchDoc
size A3; DocumentNumber: 2; SheetNumber: 12; SheetTotal: 20
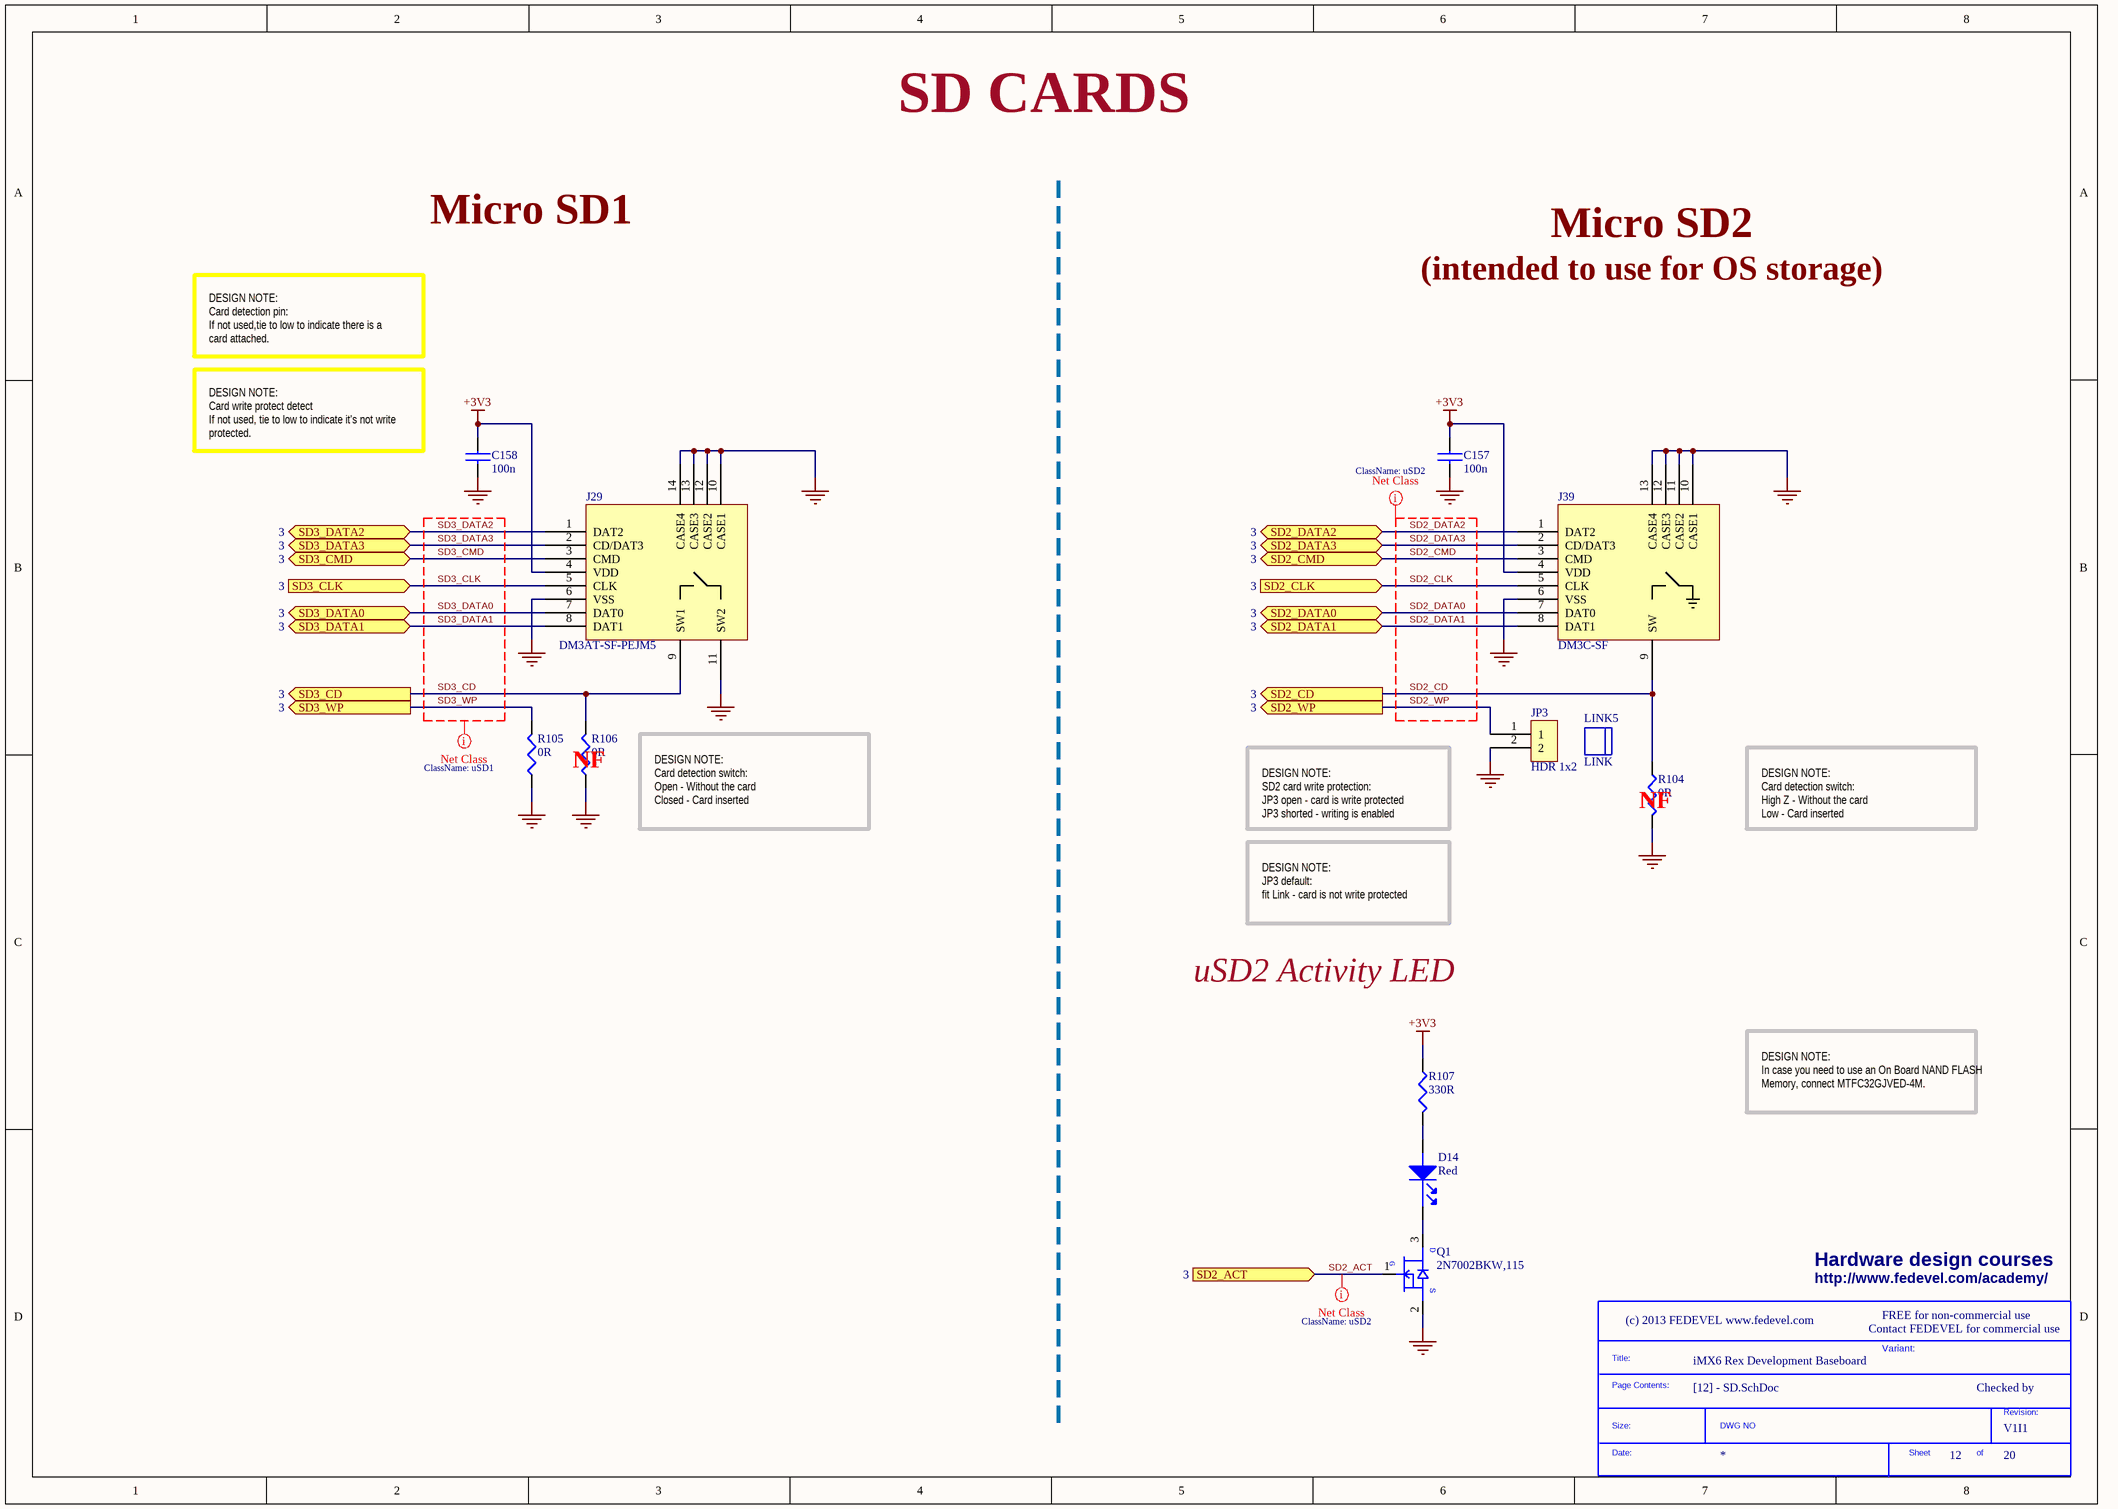
[diagram p9: [12] - SD.SchDoc]

### Parts
(Parts that share a designator on the sheet are numbered #1, #2 ... from top to bottom, then left to right.)
*#8  SDTitleBlock  (value not drawn)  (graphical)
C157  100n  [C0402]
C158  100n  [C0402]
D14  Red  [LED_0603]
J29  DM3AT-SF-PEJM5  [uSD_DM3AT]
J39  DM3C-SF  [uSD_DM3CS]
JP3  HDR 1x2  [HDR_1x2_2.54MM]
LINK5  LINK  (mechanical)
Q1  2N7002BKW,115  [SC70_SOT323]
R104  0R  [R0402]
R105  0R  [R0402]
R106  0R  [R0402]
R107  330R  [R0402]

### Ports
SD2_ACT (in, see 3), SD2_CD (out, see 3), SD2_CLK (in, see 3), SD2_CMD (bidir, see 3), SD2_DATA0 (bidir, see 3), SD2_DATA1 (bidir, see 3), SD2_DATA2 (bidir, see 3), SD2_DATA3 (bidir, see 3), SD2_WP (out, see 3), SD3_CD (out, see 3), SD3_CLK (in, see 3), SD3_CMD (bidir, see 3), SD3_DATA0 (bidir, see 3), SD3_DATA1 (bidir, see 3), SD3_DATA2 (bidir, see 3), SD3_DATA3 (bidir, see 3), SD3_WP (out, see 3)

### Nets
+3V3: C157.1 C158.1 J29.4(VDD) J39.4(VDD) R107.1
GND: C157.2 C158.2 J29.6(VSS) J29.10(CASE1) J29.11(SW2) J29.12(CASE2) J29.13(CASE3) J29.14(CASE4) J39.6(VSS) J39.10(CASE1) J39.11(CASE2) J39.12(CASE3) J39.13(CASE4) JP3.2 Q1.2(SOURCE) R104.1 R105.1 R106.1
SD2_ACT: Q1.1(GATE) ; port SD2_ACT
SD2_CD: J39.9(SW) R104.2 ; port SD2_CD
SD2_CLK: J39.5(CLK) ; port SD2_CLK
SD2_CMD: J39.3(CMD) ; port SD2_CMD
SD2_DATA0: J39.7(DAT0) ; port SD2_DATA0
SD2_DATA1: J39.8(DAT1) ; port SD2_DATA1
SD2_DATA2: J39.1(DAT2) ; port SD2_DATA2
SD2_DATA3: J39.2(CD/DAT3) ; port SD2_DATA3
SD2_WP: JP3.1 ; port SD2_WP
SD3_CD: J29.9(SW1) R106.2 ; port SD3_CD
SD3_CLK: J29.5(CLK) ; port SD3_CLK
SD3_CMD: J29.3(CMD) ; port SD3_CMD
SD3_DATA0: J29.7(DAT0) ; port SD3_DATA0
SD3_DATA1: J29.8(DAT1) ; port SD3_DATA1
SD3_DATA2: J29.1(DAT2) ; port SD3_DATA2
SD3_DATA3: J29.2(CD/DAT3) ; port SD3_DATA3
SD3_WP: R105.2 ; port SD3_WP
NetD14_1: D14.1(cathode) Q1.3(DRAIN)
NetD14_2: D14.2(ANODE) R107.2

### Layout directives
net class uSD2: SD2_ACT, SD2_CD, SD2_CLK, SD2_CMD, SD2_DATA0, SD2_DATA1, SD2_DATA2, SD2_DATA3, SD2_WP
net class uSD1: SD3_CD, SD3_CLK, SD3_CMD, SD3_DATA0, SD3_DATA1, SD3_DATA2, SD3_DATA3, SD3_WP

### Notes on the sheet
- SD CARDS
- Micro SD1
- Micro SD2
- (intended to use for OS storage)
- DESIGN NOTE:
  Card detection pin:
  If not used,tie to low to indicate there is a card attached.
- DESIGN NOTE:
  Card write protect detect
  If not used, tie to low to indicate it's not write protected.
- (near R106) NF
- DESIGN NOTE:
  Card detection switch:
  Open - Without the card
  Closed - Card inserted
- DESIGN NOTE:
  SD2 card write protection:
  JP3 open - card is write protected
  JP3 shorted - writing is enabled
- (near R104) NF
- DESIGN NOTE:
  Card detection switch:
  High Z - Without the card
  Low - Card inserted
- DESIGN NOTE:
  JP3 default:
  fit Link - card is not write protected
- uSD2 Activity LED
- DESIGN NOTE:
  In case you need to use an On Board NAND FLASH Memory, connect MTFC32GJVED-4M.
- Hardware design courses
- http://www.fedevel.com/academy/
- Contact FEDEVEL for commercial use
- FREE for non-commercial use
- Variant:
- Checked by
- (in symbol 2N7002BKW,115) D; G; S
- (in symbol SDTitleBlock) Title:; Page Contents:; Revision:; Size:; DWG NO; Date:; Sheet; of

### Library data of the parts
C157 C158 = C1005X5R1H104K: as C120 on sheet [11] - AUDIO1; Category: Capacitors; Supplier Part Number: 445-5942-1-ND; Manufacturer Part Number: C1005X5R1H104K; Operating Temperature: -55°C ~ 85°C; Package / Case: 0402 (1005 Metric); Price 1k [$]: 0.02340; .Checked SCH: used; Voltage - Rated: 50V; Supplier: Digikey; Supplier 1: Digi-Key; Supplier Part Number 1: 445-5942-1-ND; RoHS: RoHS Compliant; Stock 1: 106926; Pricing 1: 1=0.27, 10=0.18, 100=0.072, 250=0.05176, 500=0.0369, 1000=0.027 (USD); Tolerance: ±10%; Temperature Coefficient: X5R; Mounting Type: Surface Mount, MLCC; Applications: General Purpose; Ratings: -; Size / Dimension: 0.039" L x 0.020" W (1.00mm x 0.50mm); Height - Seated (Max): -; Thickness (Max): 0.022" (0.55mm); Lead Spacing: -; Features: -; Packaging: Cut Tape (CT); Lead Style: -; ComponentLink1URL: http://www.tdk.co.jp/tefe02/e412_c.pdf; ComponentLink1Description: http://www.tdk.co.jp/tefe02/e412_c.pdf
D14 = LS L29K-H1J2-1-Z: LED SMARTLED RED 630NM 0603 SMD; Manufacturer: OSRAM Opto Semiconductors Inc; Millicandela Rating: 4.95mcd; Voltage - Forward (Vf) Typ: 1.8V; Current - Test: 2mA; Wavelength - Peak: 643nm; Viewing Angle: 160°; Lens Type: Diffused; Lens Style/Size: Rectangle with Flat Top, 1.3mm x 0.8mm; Luminous Flux @ Current - Test: 20 mlm; .Checked PCB: RF; Supplier 1: Digi-Key; Supplier Part Number 1: 475-1195-1-ND; Manufacturer Part Number: LS L29K-H1J2-1-Z; RoHS: RoHS Compliant; Category: Optoelectronics; Stock 1: 71670; Pricing 1: 1=0.16, 10=0.137, 100=0.1093, 250=0.09564, 500=0.08744 (USD); Color: Red; Wavelength - Dominant: 630nm; Package / Case: 0603 (1608 Metric); Size / Dimension: 1.70mm L x 0.80mm W; Height: 0.65mm; Mounting Type: Surface Mount; Packaging: Cut Tape (CT); ComponentLink1URL: http://catalog.osram-os.com/catalogue/catalogue.do;jsessionid=DB7CFDBAC5AF1E216E45F622E867085A?act=downloadFile&favOid=020000010003f9de000100b6; ComponentLink1Description: http://catalog.osram-os.com/catalogue/catalogue.do;jsessionid=DB7CFDBAC5AF1E216E45F622E867085A?act=downloadFile&favOid=020000010003f9de000100b6; .Checked SCH: RF
J29 = DM3AT-SF-PEJM5: CONN MICRO SD R/A PUSH-PUSH SMD; Manufacturer: Hirose Electric Co Ltd; .Checked PCB: MM; Connector Type: Connector and Ejector; Card Type: Secure Digital - microSD TransFlash; Number of Positions: 10 (8 + 2); Insertion, Removal Method: Push In, Push Out; .Checked SCH: MM; Category: Connectors, Interconnects; Supplier Part Number: HR1964CT-ND; Family: Memory - PC Card Connectors; Manufacturer Part Number: DM3AT-SF-PEJM5; Price 1k [$]: 1.85200; Supplier: Digikey; Supplier 1: Digi-Key; Supplier Part Number 1: HR1964CT-ND; RoHS: RoHS Compliant; Stock 1: 7044; Pricing 1: 1=2.96, 10=2.457, 50=2.0476, 100=1.82, 250=1.5106, 500=1.365 (USD); Ejector Side: -; Mounting Type: Surface Mount, Right Angle; Features: Switch; Height Above Board: 0.066" (1.68mm); Mounting Feature: Normal, Standard - Top; Packaging: Cut Tape (CT); Contact Finish: Gold; Contact Finish Thickness: -; ComponentLink1URL: http://www.hirose.co.jp/cataloge_hp/e60900232.pdf; ComponentLink1Description: http://www.hirose.co.jp/cataloge_hp/e60900232.pdf
J39 = DM3C-SF: CONN MICRO SD R/A HING TYPE SMD; Manufacturer: Hirose Electric Co Ltd; Card Type: Secure Digital - microSD™; Number of Positions: 10 (8 + 2); Connector Type: Connector and Ejector; Insertion, Removal Method: Hinged Lid; .Creator: MM; Supplier 1: Digi-Key; Manufacturer Part Number: DM3C-SF; RoHS: RoHS Compliant; Category: Connectors, Interconnects; Stock 1: 87; Pricing 1: 1=2.36, 10=1.96, 25=1.8152, 50=1.6368, 100=1.452, 250=1.2738, 500=1.1616 (USD); Packaging: Cut Tape (CT); Ejector Side: -; Mounting Type: Surface Mount, Right Angle; Features: Switch; Height Above Board: 0.072" (1.83mm); Mounting Feature: Normal, Standard - Top; Contact Finish: Gold; Contact Finish Thickness: -; ComponentLink1URL: http://www.hirose.co.jp/cataloge_hp/e60900232.pdf; ComponentLink1Description: http://www.hirose.co.jp/cataloge_hp/e60900232.pdf; Supplier Part Number 1: HR1940CT-ND; .Checked PCB: MM; .Checked SCH: MM
JP3 = 68001-202HLF: BERGSTIK II .100" SR STRAIGHT; Manufacturer: FCI; Connector Type: Header, Unshrouded; Number of Positions: 2; Number of Positions Loaded: All; Pitch: 0.100" (2.54mm); .Checked PCB: RF; Supplier 1: Digi-Key; Supplier Part Number 1: 609-3469-ND; Manufacturer Part Number: 68001-202HLF; RoHS: RoHS Compliant; Category: Connectors, Interconnects; Stock 1: 13680; Pricing 1: 1=0.45, 10=0.265, 100=0.1172, 250=0.09828, 500=0.09072, 1000=0.07938, 5000=0.05065 (USD); Contact Type: Male Pin; Number of Rows: 1; Row Spacing: -; Contact Mating Length: 0.230" (5.84mm); Mounting Type: Through Hole; Termination: Solder; Fastening Type: -; Features: -; Contact Finish: Gold; Contact Finish Thickness: 15µin (0.38µm); Color: Black; Packaging: Bulk; ComponentLink1URL: http://portal.fciconnect.com/res/en/pdffiles/doc_search/68000.pdf; ComponentLink1Description: http://portal.fciconnect.com/res/en/pdffiles/doc_search/68000.pdf; .Checked SCH: RF
LINK5 = QPC02SXGN-RC: CONN JUMPER SHORTING .100" GOLD; Manufacturer: Sullins Connector Solutions; Gender: Female Sockets; Number of Positions or Pins (Grid): 2 (1 x 2); Pitch: 0.100" (2.54mm); .Checked SCH: RF; Supplier 1: Digi-Key; Supplier Part Number 1: S9337-ND; Manufacturer Part Number: QPC02SXGN-RC; RoHS: RoHS Compliant; Category: Connectors, Interconnects; Stock 1: 23274; Pricing 1: 1=0.11, 10=0.066, 25=0.0468, 50=0.0384, 100=0.033, 250=0.02792, 500=0.0258, 1000=0.0228, 2500=0.018 (USD); Type: Open Top; Height: 0.235" (5.97mm); Contact Finish: Gold; Contact Finish Thickness: Flash; Color: -; Packaging: Bulk; ComponentLink1URL: http://www.sullinscorp.com/drawings/284_SXGN_11510.pdf; ComponentLink1Description: http://www.sullinscorp.com/drawings/284_SXGN_11510.pdf
Q1 = 2N7002BKW,115: MOSFET N-CH 60V 310MA SOT323; Manufacturer: NXP Semiconductors; FET Type: MOSFET N-Channel, Metal Oxide; FET Feature: Logic Level Gate; Rds On (Max) @ Id, Vgs: 1.6 Ohm @ 500mA, 10V; Vgs(th) (Max) @ Id: 2.1V @ 250µA; Gate Charge (Qg) @ Vgs: 0.6nC @ 4.5V; Input Capacitance (Ciss) @ Vds: 50pF @ 10V; Power - Max: 275mW; .Checked PCB: RF; Supplier 1: Digi-Key; Supplier Part Number 1: 568-5980-1-ND; Manufacturer Part Number: 2N7002BKW,115; RoHS: RoHS Compliant; Category: Discrete Semiconductor Products; Stock 1: 15666; Pricing 1: 1=0.39, 10=0.354, 25=0.2548, 100=0.1983, 250=0.12456, 500=0.10616, 1000=0.07233 (USD); Drain to Source Voltage (Vdss): 60V; Current - Continuous Drain (Id) @ 25° C: 310mA; Mounting Type: Surface Mount; Package / Case: SC-70, SOT-323; Supplier Device Package: SC-70; Packaging: Cut Tape (CT); ComponentLink1URL: http://www.nxp.com/documents/data_sheet/2N7002BKW.pdf; ComponentLink1Description: http://www.nxp.com/documents/data_sheet/2N7002BKW.pdf; .Checked SCH: RF
R104-R106 = RC0402JR-070RL: as R24 on sheet [11] - AUDIO1; Category: Resistors; Supplier Part Number: 311-0.0JRCT-ND; Manufacturer Part Number: RC0402JR-070RL; Package / Case: 0402 (1005 Metric); Price 1k [$]: 0.01389; Value: 0R; .Checked SCH: used; Supplier: Digikey; Supplier 1: Digi-Key; Supplier Part Number 1: 311-0.0JRCT-ND; RoHS: RoHS Compliant; Stock 1: 1106330; Pricing 1: 10=0.012, 50=0.009, 100=0.0069, 250=0.00512, 500=0.0038, 1000=0.00253 (USD); Composition: Thick Film; Features: -; Temperature Coefficient: -; Size / Dimension: 0.039" L x 0.020" W (1.00mm x 0.50mm); Height: 0.016" (0.40mm); Number of Terminations: 2; Packaging: Cut Tape (CT); ComponentLink1URL: http://www.yageo.com/documents/recent/PYu-RC0402_51_RoHS_L_6.pdf; ComponentLink1Description: http://www.yageo.com/documents/recent/PYu-RC0402_51_RoHS_L_6.pdf
R107 = CRCW0402330RFKED: RES 330 OHM 1/16W 1% 0402 SMD; Manufacturer: Vishay Dale; Resistance (Ohms): 330; Power (Watts): 0.063W, 1/16W; Temperature Coefficient: ±100ppm/°C; .Checked PCB: RF; Supplier 1: Digi-Key; Supplier Part Number 1: 541-330LCT-ND; Manufacturer Part Number: CRCW0402330RFKED; RoHS: RoHS Compliant; Category: Resistors; Stock 1: 49303; Pricing 1: 10=0.083, 50=0.0444, 200=0.0255, 1000=0.0174 (USD); Composition: Thick Film; Features: -; Tolerance: ±1%; Package / Case: 0402 (1005 Metric); Size / Dimension: 0.039" L x 0.020" W (1.00mm x 0.50mm); Height: 0.016" (0.40mm); Number of Terminations: 2; Packaging: Cut Tape (CT); ComponentLink1URL: http://www.vishay.com/doc?20035; ComponentLink1Description: http://www.vishay.com/doc?20035; .Checked SCH: RF